# EAGLE design FIRST FINAL CPO (EAGLE 7.7.0)
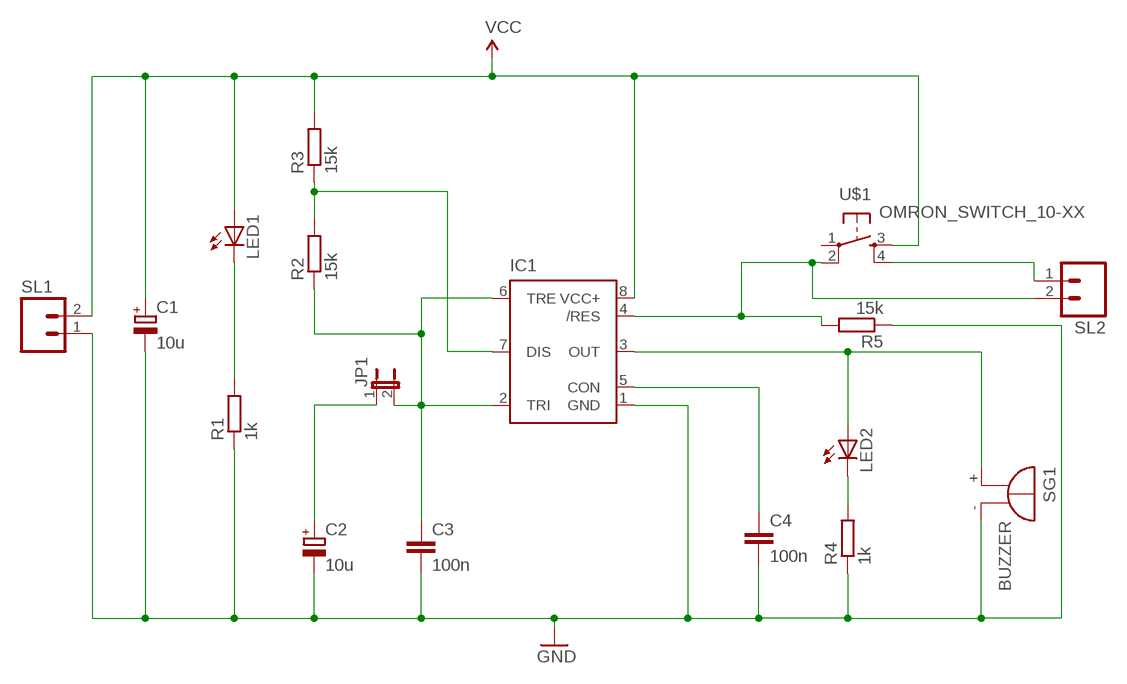
[diagram p0: schematic, sheet 1]

## Parts
C1  10u  CPOL-EUE2.5-5  [E2,5-5]
C2  10u  CPOL-EUE2.5-5  [E2,5-5]
C3  100n  C-EU025-025X050  [C025-025X050]
C4  100n  C-EU025-025X050  [C025-025X050]
IC1  NE555P  [DIL-08]
JP1  JP1E  [JP1]
LED1  LED5MM  [LED5MM]
LED2  LED5MM  [LED5MM]
R1  1k  R-EU_0207/7  [0207/7]
R2  15k  R-EU_0207/7  [0207/7]
R3  15k  R-EU_0207/7  [0207/7]
R4  1k  R-EU_0207/7  [0207/7]
R5  15k  R-EU_0207/7  [0207/7]
SG1  BUZZER  [F/TMB]
SL1  M02  [02P]
SL2  M02  [02P]
U$1  OMRON_SWITCH_10-XX  [B3F-10XX]

## Nets
GND: C1.- C2.- C3.2 C4.2 IC1.1(GND) R1.1 R4.1 R5.1 SG1.- SL1.1
N$2: LED1.K(C) R1.2
N$4: C2.+ JP1.1
N$5: C3.1 IC1.2(TRI) IC1.6(TRE) JP1.2 R2.1
N$6: IC1.3(OUT) LED2.A SG1.+
N$7: LED2.K(C) R4.2
N$8: IC1.7(DIS) R2.2 R3.1
N$10: IC1.4(/RES) R5.2 SL2.2 U$1.2(P1)
N$11: SL2.1 U$1.4(S1)
N$12: C4.1 IC1.5(CON)
VCC: C1.+ IC1.8(VCC+) LED1.A R3.2 SL1.2 U$1.3(S)
Unconnected: U$1.1(P)

## Library data of the parts
C1 C2 = rcl:CPOL-EU: POLARIZED CAPACITOR, European symbol
C3 C4 = rcl:C-EU: CAPACITOR, European symbol
IC1 = SparkFun-AnalogIC:NE555: General purpose bipolar Timer; MF: Arrow Electronics; MPN: NE555N; OC_FARNELL: 1467742; OC_NEWARK: 89K1486
JP1 = jumper:JP1E: JUMPER
LED1 LED2 = CEDT_JANUARY_2015_v5:LED
R1-R5 = rcl:R-EU_: RESISTOR, European symbol
SG1 = CEDT_JANUARY_2015_v5:BUZZER: BUZZER Source: Buerklin; OC_FARNELL: unknown; OC_NEWARK: unknown
SL1 SL2 = CEDT_JANUARY_2015_v5:M02: AMP QUICK CONNECTOR
U$1 = CEDT_JANUARY_2015_v5:OMRON_SWITCH

## Board
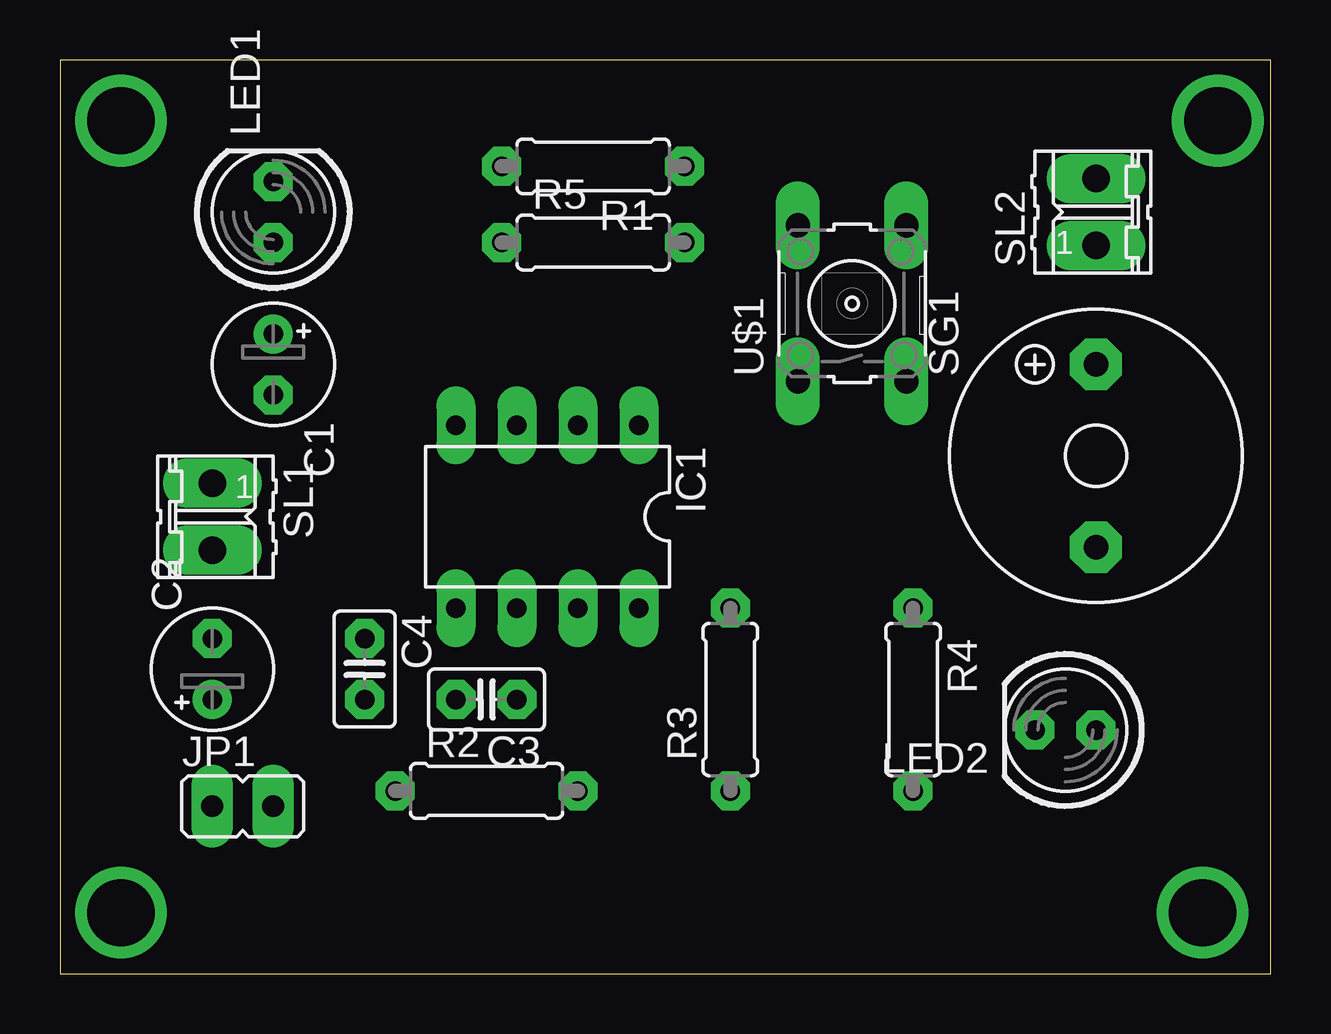
[diagram p1: board, top side]
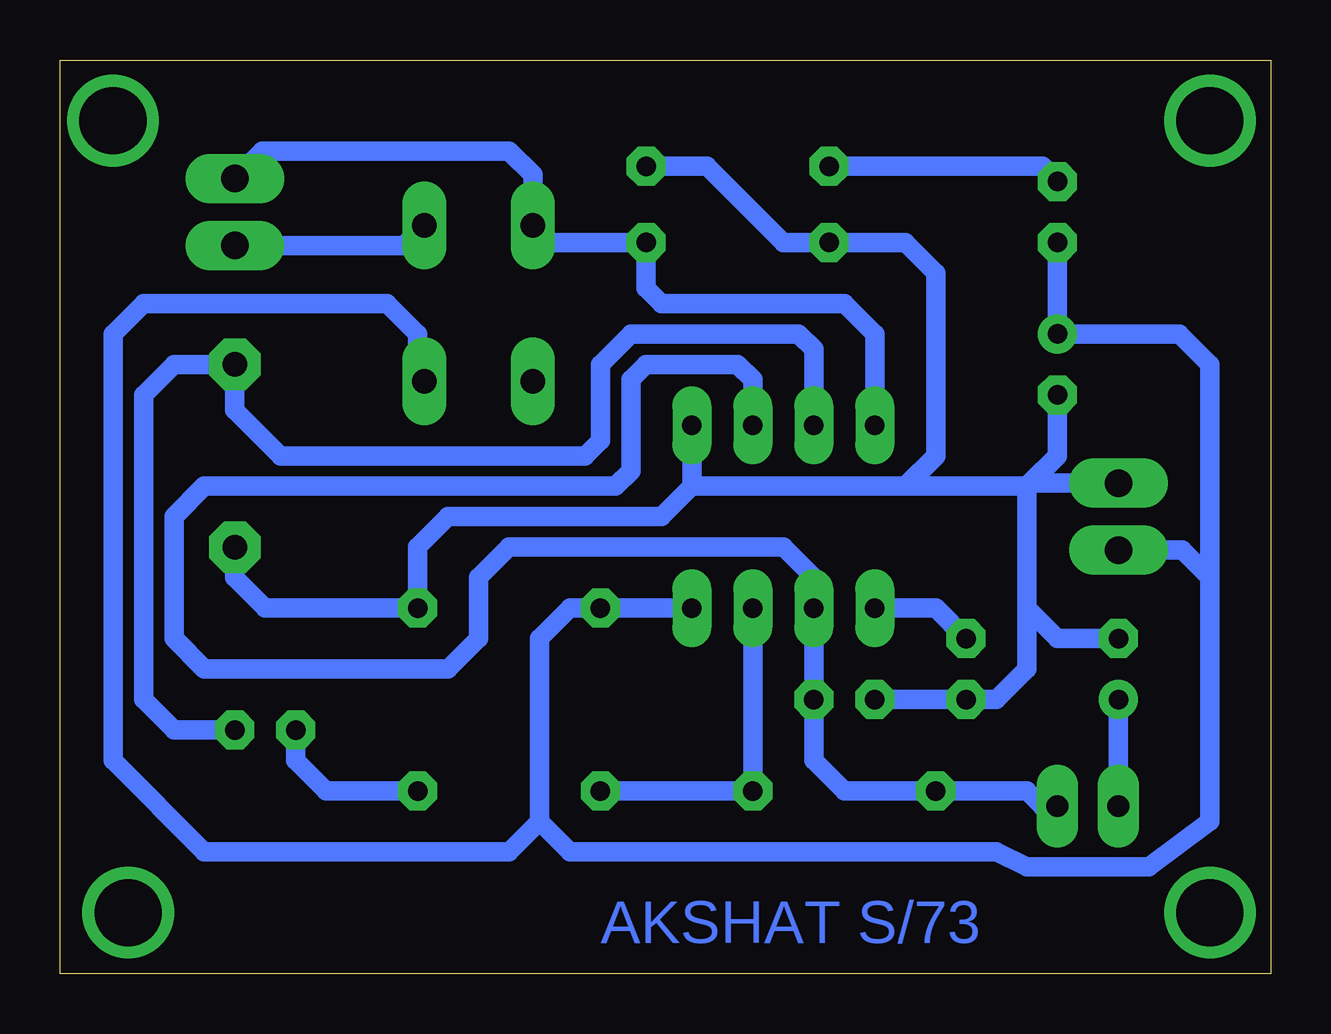
[diagram p2: board, bottom side, seen from below]

Size 50.47 x 38.09 mm. Coordinates in mm from the lower left corner, seen from the top.
Outline: 0,0 50.47,0 50.47,38.09 0,38.09 0,0
Copper layers (1*16): Top 0.035mm / dielectric 1.5mm / Bottom 0.035mm
Design rules "default *": minimum track width 16mil, minimum drill 24mil, track to track 16mil, track to pad 16mil, pad to pad 16mil, via to via 16mil, smd to smd 16mil, copper to edge 40mil, drill to drill 8mil, minimum pad ring 16mil, minimum via ring 16mil, stop-mask expansion 4mil, vias tented up to drill 0mil, thermal gap 10mil

### Footprints (pad centres in the part's own frame; a part is rotated, then mirrored left to right if it is on the bottom)
E2,5-5 = drill 0.813 pad 1.6: + -1.27,0 | drill 0.813 pad 1.6 octagon: - 1.27,0
C025-025X050 = drill 0.813 octagon: 1 -1.27,0; 2 1.27,0
DIL-08 = drill 0.813 long: 1 -3.81,-3.81; 2 -1.27,-3.81; 3 1.27,-3.81; 4 3.81,-3.81; 5 3.81,3.81; 6 1.27,3.81; 7 -1.27,3.81; 8 -3.81,3.81
JP1 = drill 0.914 long: 1 0,-1.27; 2 0,1.27
LED5MM = drill 0.813 octagon: A -1.27,0; K 1.27,0
0207/7 = drill 0.813 octagon: 1 -3.81,0; 2 3.81,0
F/TMB = drill 1.016 pad 2.159 octagon: + 3.81,0; - -3.81,0
02P = drill 1.143 long: 1 -1.397,0; 2 1.397,0
B3F-10XX = drill 1.016 long: 1 -3.251,2.261; 2 3.251,2.261; 3 -3.251,-2.261; 4 3.251,-2.261

### Placement (x,y rotation side)
C1  8.89,25.4 270 top
C2  6.35,12.7 90 top
C3  17.78,11.43 180 top
C4  12.7,12.7 270 top
IC1  20.32,19.05 180 top
JP1  7.62,6.99 270 top
LED1  8.89,31.75 90 top
LED2  41.91,10.16 180 top
R1  22.23,33.66 180 top
R2  17.78,7.62 0 top
R3  27.94,11.43 90 top
R4  35.56,11.43 270 top
R5  22.23,30.48 0 top
SG1  43.18,21.59 90 top
SL1  6.35,19.05 270 top
SL2  43.18,31.75 90 top
U$1  33.02,27.94 90 top

### Tracks (layer width: path | path; a pad name or v marks a point on that pad's centre or on a via)
GND
  Bottom 0.813: 24.13,20.32 15.24,20.32 | 15.24,20.32 13.97,21.59 13.97,29.21 15.24,30.48 R5.1 20.32,30.48 23.5,33.66 R1.1 | 24.13,21.59 IC1.1 24.13,20.32 | SG1.- 43.18,16.51 41.91,15.24 R4.1 35.56,17.78 34.29,19.05 25.4,19.05 24.13,20.32 | 10.16,15.24 10.16,12.7 11.43,11.43 C4.2 C3.2 | C2.- 8.89,13.97 10.16,15.24 | SL1.1 10.03,20.45 | 10.03,20.45 10.16,20.32 | C1.- 8.89,21.59 10.03,20.45 | 10.16,20.32 10.16,15.24 | 10.16,20.32 15.24,20.32
N$1  (via drill 2.8 pad 3.81)
  other vias: 2.54,35.56
N$2
  Bottom 0.813: R1.2 9.53,33.66 LED1.K
N$3  (via drill 2.8 pad 3.81)
  other vias: 2.54,2.54
N$4
  Bottom 0.813: C2.+ JP1.1
N$5
  Bottom 0.813: IC1.2 21.59,24.77 22.23,25.4 26.04,25.4 26.67,24.77 26.67,20.95 27.3,20.32 44.45,20.32 45.72,19.05 45.72,13.97 44.45,12.7 34.29,12.7 33.02,13.97 33.02,16.51 31.75,17.78 20.32,17.78 19.05,16.51 IC1.6 C3.1 19.05,8.89 17.78,7.62 R2.1 10.16,7.62 9.53,6.99 JP1.2
N$6
  Bottom 0.813: 19.05,24.13 IC1.3 19.05,26.04 19.68,26.67 26.67,26.67 27.94,25.4 27.94,22.23 28.57,21.59 41.27,21.59 43.18,23.5 SG1.+ 45.72,25.4 46.99,24.13 46.99,11.43 45.72,10.16 LED2.A
N$7
  Bottom 0.813: R4.2 39.37,7.62 40.64,8.89 LED2.K
N$8
  Bottom 0.813: IC1.7 R2.2 R3.1
N$9  (via drill 2.8 pad 3.81)
  other vias: 47.62,2.54
N$10
  Bottom 0.813: IC1.4 16.51,26.67 17.78,27.94 25.4,27.94 26.04,28.57 R5.2 | R5.2 30.76,30.48 U$1.2 30.76,33.3 31.75,34.29 42.04,34.29 SL2.2 | R5.2 26.04,29.84
N$11
  Bottom 0.813: SL2.1 36.12,30.35 U$1.4
N$12
  Bottom 0.813: IC1.5 13.97,15.24 C4.1
N$13  (via drill 2.8 pad 3.81)
  other vias: 48.26,35.56
VCC
  Bottom 0.813: IC1.8 R3.2 29.21,15.24 30.48,13.97 30.48,6.35 | 2.54,16.51 2.54,6.35 5.08,4.45 10.16,4.45 11.43,5.08 29.21,5.08 30.48,6.35 | 2.54,16.51 2.54,25.4 3.81,26.67 C1.+ LED1.A | SL1.2 3.68,17.65 2.54,16.51 | U$1.3 35.56,24.97 35.56,26.67 36.83,27.94 46.99,27.94 48.26,26.67 48.26,8.89 44.45,5.08 31.75,5.08 30.48,6.35

### Text on the board
Bottom: AKSHAT S/73